# Altium schematic sheet McBSP_GPIO.SchDoc
size A4
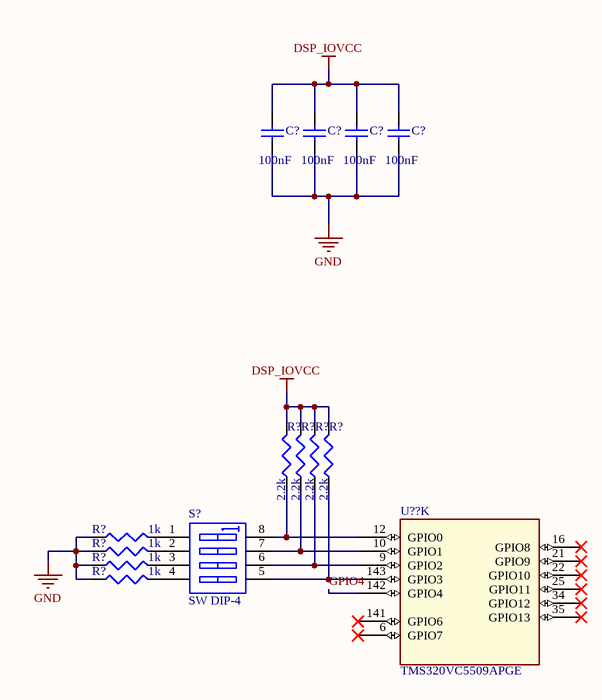
[diagram p0: McBSP_GPIO.SchDoc]

## Parts
(Parts that share a designator on the sheet are numbered #1, #2 ... from top to bottom, then left to right.)
C?#1  value 100nF  [0402]  (hidden comment: Cap Semi)
C?#2  value 100nF  [0402]  (hidden comment: Cap Semi)
C?#3  value 100nF  [0402]  (hidden comment: Cap Semi)
C?#4  value 100nF  [0402]  (hidden comment: Cap Semi)
R?#1  value 2.2k  [3225[1210]]  (hidden comment: Res3)
R?#2  value 2.2k  [3225[1210]]  (hidden comment: Res3)
R?#3  value 2.2k  [3225[1210]]  (hidden comment: Res3)
R?#4  value 2.2k  [3225[1210]]  (hidden comment: Res3)
R?#5  value 1k  [3225[1210]]  (hidden comment: Res3)
R?#6  value 1k  [3225[1210]]  (hidden comment: Res3)
R?#7  value 1k  [3225[1210]]  (hidden comment: Res3)
R?#8  value 1k  [3225[1210]]  (hidden comment: Res3)
S?  SW DIP-4  [SO8]
U??  TMS320VC5509APGE  [TMSVC5509APGA]  (part K of 16)

## Nets
DSP_IOVCC: C?#1.1 C?#2.1 C?#3.1 C?#4.1 R?#1.2 R?#2.2 R?#3.2 R?#4.2
GND: C?#1.2 C?#2.2 C?#3.2 C?#4.2 R?#5.1 R?#6.1 R?#7.1 R?#8.1
GPIO4: U??.142(GPIO4)
NetR?#1_1: R?#1.1 S?.8(B1) U??.12(GPIO0)
NetR?#2_1: R?#2.1 S?.7(B2) U??.10(GPIO1)
NetR?#3_1: R?#3.1 S?.6(B3) U??.9(GPIO2)
NetR?#4_1: R?#4.1 S?.5(B4) U??.143(GPIO3)
NetR?#5_2: R?#5.2 S?.1(A1)
NetR?#6_2: R?#6.2 S?.2(A2)
NetR?#7_2: R?#7.2 S?.3(A3)
NetR?#8_2: R?#8.2 S?.4(A4)

Not connected (* = marked no-connect by the designer): U?? 6(GPIO7)* 16(GPIO8)* 21(GPIO9)* 22(GPIO10)* 25(GPIO11)* 34(GPIO12)* 35(GPIO13)* 141(GPIO6)*

## Library data of the parts
C?#1-C?#4 = Cap Semi: Capacitor (Semiconductor SIM Model); Published: 8-Jun-2000; LatestRevisionDate: 17-Jul-2002; LatestRevisionNote: Re-released for DXP Platform.; PackageReference: C1206; Publisher: Altium Limited
R?#1-R?#8 = Res3: Resistor; Published: 8-Jun-2000; LatestRevisionDate: 04-Mar-2005; LatestRevisionNote: PCB Footprint replaced.; PackageReference: J1-0603; Publisher: Altium Limited
S? = SW DIP-4: DIP Switch, 4 Position, SPST; Published: 24-Mar-1999; LatestRevisionDate: 17-Jul-2002; LatestRevisionNote: Re-released for DXP Platform.; PackageReference: SO8; Publisher: Altium Limited; Code_JEDEC: MS-012-AA; Code_IPC: SO8